# EAGLE design snes1 (EAGLE 7.7.0)
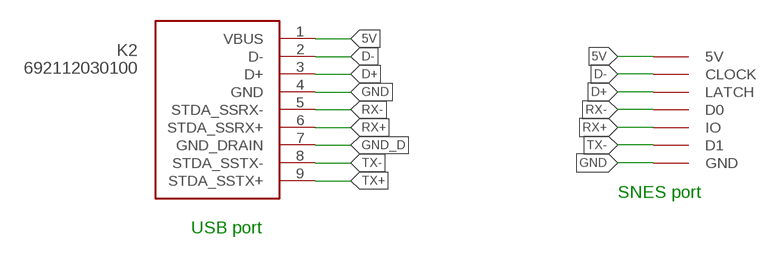
[diagram p0: schematic, sheet 1]

## Parts
K2  692112030100  [692112030100]
U$1  SNESCONN  [SNESCONN]

## Nets
5V: K2.1(VBUS) U$1.5V
D+: K2.3(D+) U$1.LATCH
D-: K2.2(D-) U$1.CLOCK
GND: K2.4(GND) U$1.GND
GND_D: K2.7(GND_DRAIN)
RX+: K2.6(STDA_SSRX+) U$1.IO
RX-: K2.5(STDA_SSRX-) U$1.D0
TX+: K2.9(STDA_SSTX+)
TX-: K2.8(STDA_SSTX-) U$1.D1

## Notes on the sheet
- SNES port
- USB port

## Library data of the parts
K2 = Wuerth_Elektronik_eiCan_Communication_Connectors_STENCIL:692112030100: WR-COM USB 3.0 SMT PLUG WITH CLIPTYPE A
U$1 = gamepad-conn:SNESCONN

## Board
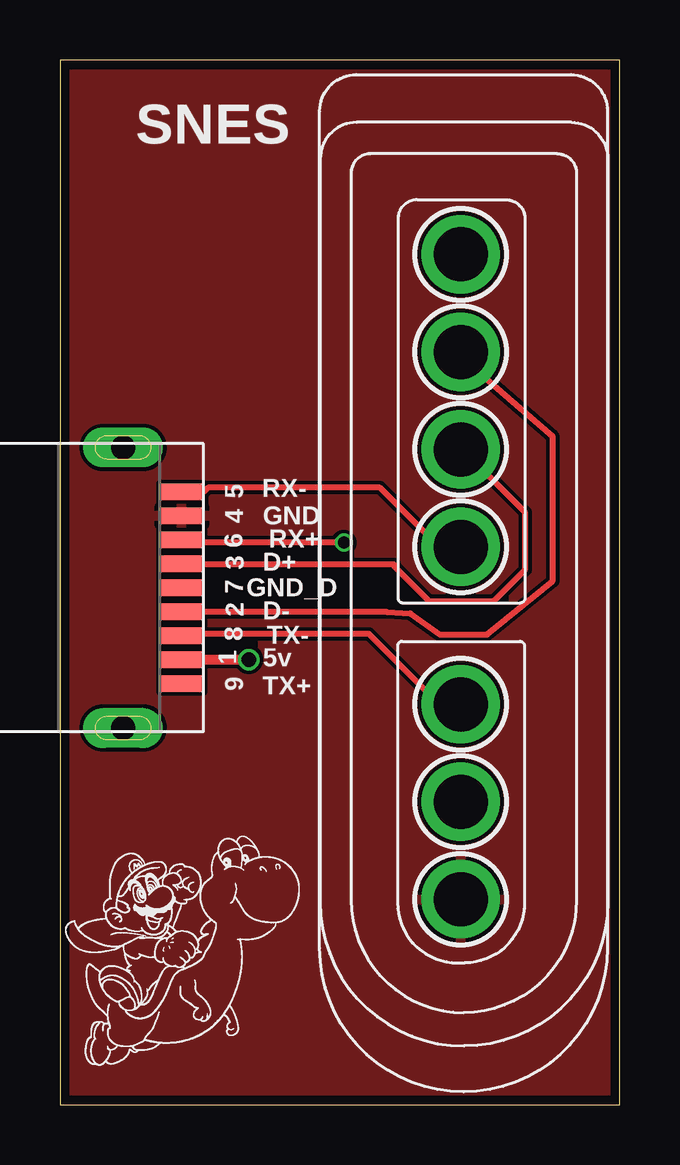
[diagram p1: board, top side]
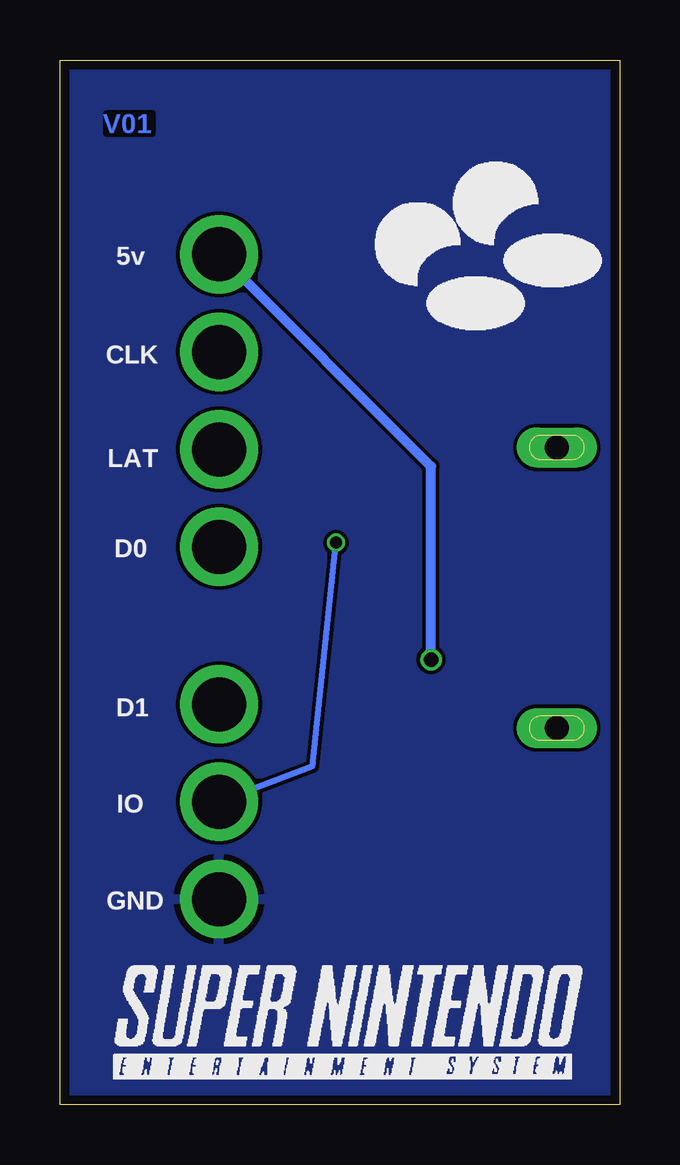
[diagram p2: board, bottom side, seen from below]

Size 23.35 x 43.56 mm. Coordinates in mm from the lower left corner, seen from the top.
Outline: 0,0 23.35,0 23.35,43.56 0,43.56 0,0
Copper layers (1*16): Top 0.035559375mm / dielectric 1.6mm / Bottom 0.035559375mm
Design rules "oshpark-2layer": minimum track width 6mil, minimum drill 10mil, track to track 6mil, track to pad 6mil, pad to pad 6mil, via to via 6mil, smd to smd 6mil, copper to edge 15mil, drill to drill 6mil, minimum pad ring 5mil, minimum via ring 5mil, stop-mask expansion 2.5mil, vias tented up to drill 0mil, thermal gap 10mil

### Footprints (pad centres in the part's own frame; a part is rotated, then mirrored left to right if it is on the bottom)
692112030100 = smd 0.7 x 1.8: 1 -3,0; 2 -1,0; 3 1,0; 4 3,0; 5 4,0; 6 2,0; 7 0,0; 8 -2,0; 9 -4,0 | drill 1 pad 1.676 long: Z1 5.85,2.45; Z2 -5.85,2.45
SNESCONN = drill 2.25 pad 3.25: 5V 0,4.064; CLOCK 4.064,4.064; D0 12.192,4.064; D1 18.756,4.064; GND 26.884,4.064; IO 22.82,4.064; LATCH 8.128,4.064

### Placement (x,y rotation side)
K2  5.08,21.56 90 top
U$1  12.65,35.46 270 top

### Tracks (layer width: path | path; a pad name or v marks a point on that pad's centre or on a via)
5V  (via drill 0.6)
  Top 0.406: K2.1 v7.87,18.56 v7.87,18.57
  Bottom 0.406: v7.87,18.57 7.87,26.62 U$1.5V
D+
  Top 0.152: 5.11,22.53 K2.3 | 16.84,27.25 U$1.LATCH
  Top 0.254: 5.11,22.53 13.94,22.53 13.94,22.45 15.39,21.01 18.09,21.01 19.41,22.33 19.41,24.69 16.84,27.25
D-
  Top 0.152: 16.84,31.06 16.84,31.37 U$1.CLOCK | 5.11,20.55 K2.2
  Top 0.254: 5.11,20.55 13.64,20.55 14.61,20.5 15.85,19.61 17.81,19.61 20.55,21.84 20.55,27.86 16.84,31.06
GND
  pour Bottom: 0.38,43.15 22.94,43 23.04,0.2 0.1,-0.03
  pour Top: 0.23,43.41 22.99,43.08 23.16,0.25 0.05,0
RX+  (via drill 0.5)
  Top 0.152: 5.11,23.44 K2.6
  Top 0.254: v11.84,23.44 5.11,23.44
  Bottom 0.254: v11.84,23.44 12.83,14.12 U$1.IO
RX-
  Top 0.152: 5.11,25.58 K2.5 | 16.69,23.29 U$1.D0
  Top 0.254: 5.11,25.58 6.02,25.58 6.17,25.73 13.34,25.73 15.77,23.29 16.69,23.29
TX-
  Top 0.152: 5.11,19.63 K2.8 | 16.69,16.74 U$1.D1
  Top 0.254: 5.11,19.63 12.88,19.63 15.77,16.74 16.69,16.74

### Text on the board
Bottom: V01
tPlace: SNES | 5 | RX- | 4 | GND | 6 | RX+ | 3 | D+ | 7 | GND_D | 2 | D- | 8 | TX- | 1 | 5v | 9 | TX+
bPlace: 5v | CLK | LAT | D0 | D1 | IO | GND